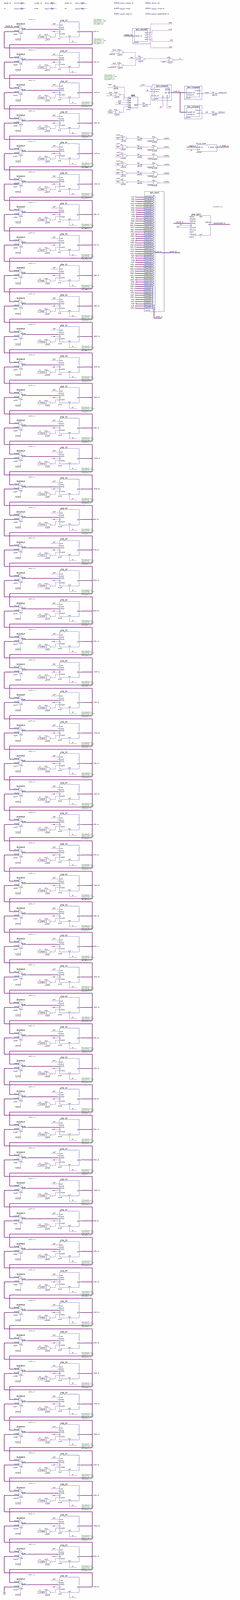
[diagram p0: schematic sheet, whole]
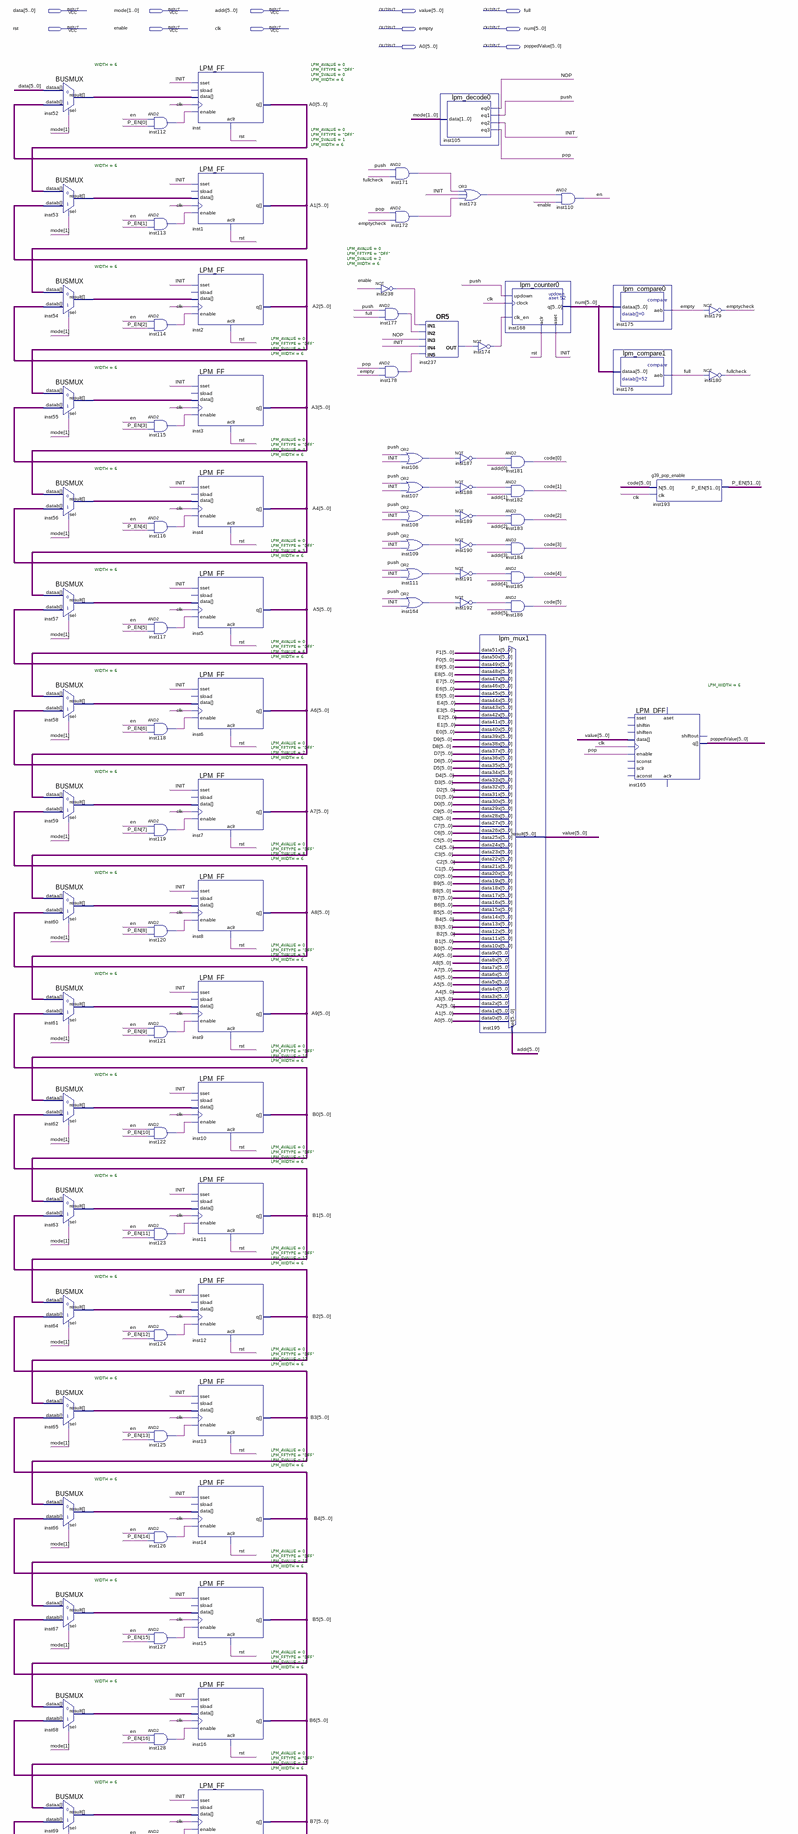
[diagram p1: schematic sheet, upper part]
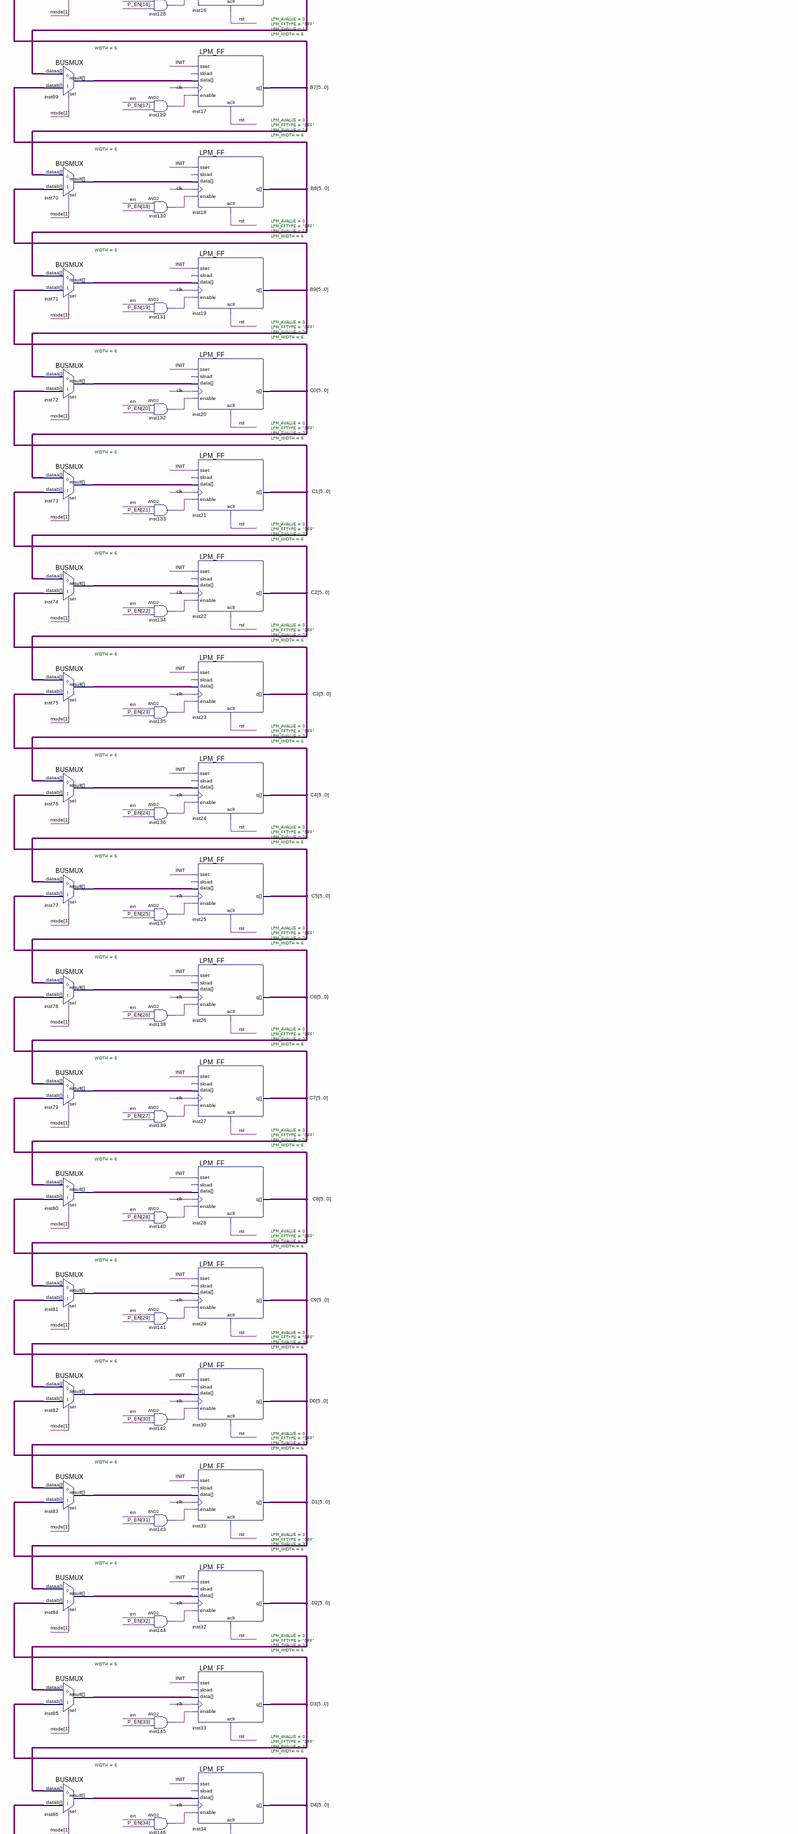
[diagram p2: schematic sheet, middle part]
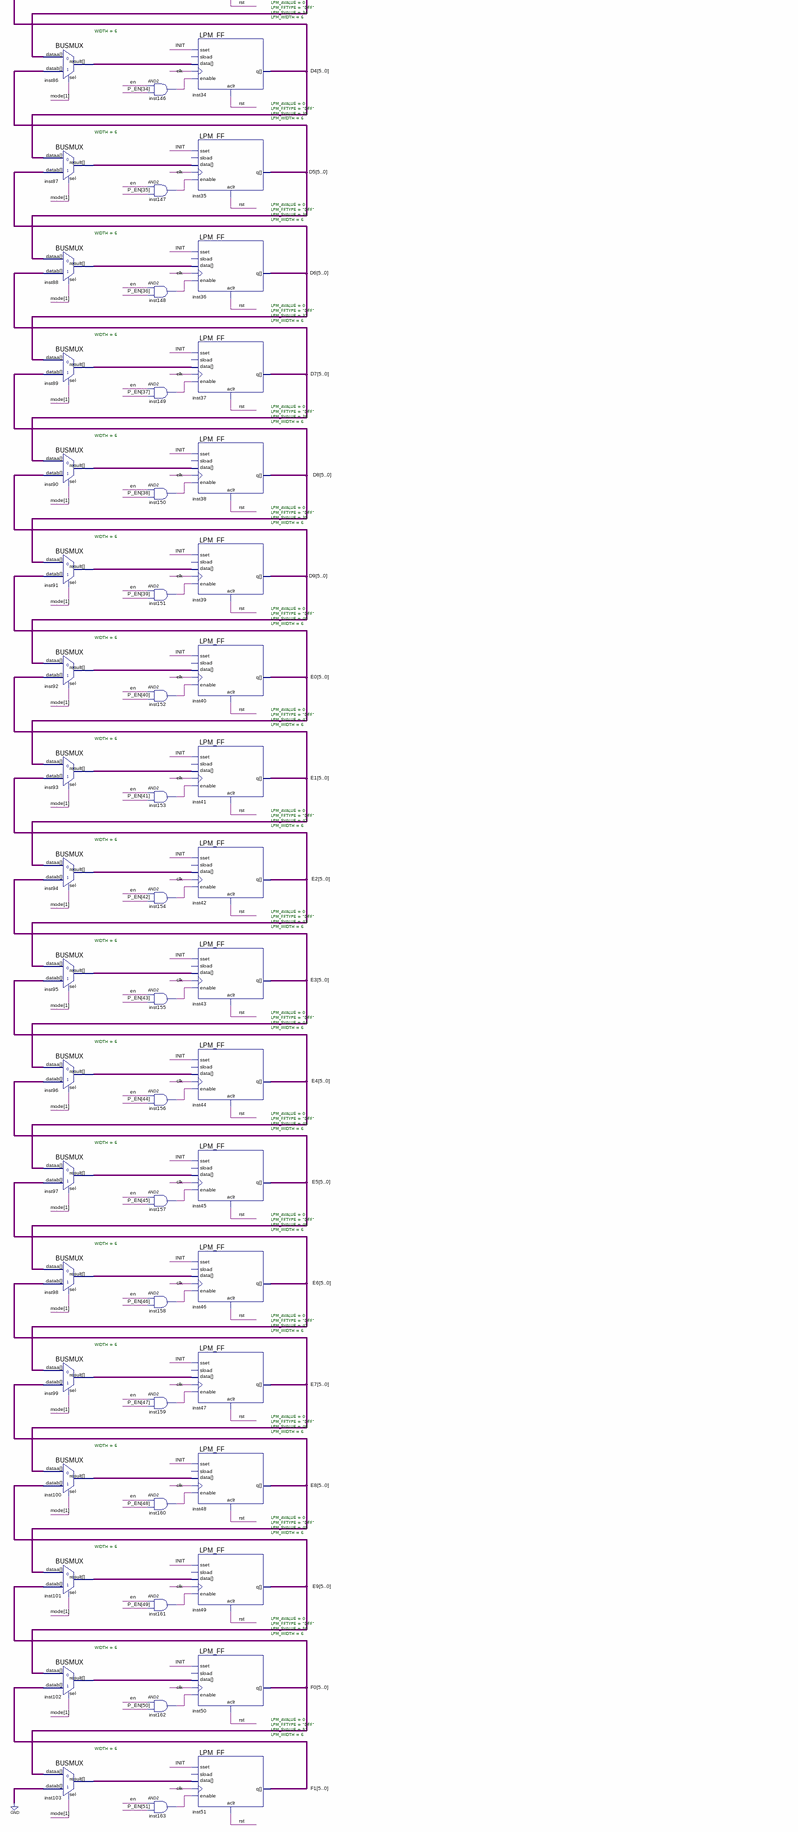
[diagram p3: schematic sheet, lower part]
// Quartus schematic g39_lab3.bdf as structural Verilog: 192 symbols, 12 pins
module g39_lab3 (
  input  [5:0] data,
  input  [1:0] mode,
  input  [5:0] addr,
  input  rst,
  input  enable,
  input  clk,
  output [5:0] value,
  output full,
  output empty,
  output [5:0] num,
  output [5:0] A0,
  output [5:0] poppedValue
);

  wire emptycheck, en, fullcheck, INIT, inst106_out, inst107_out, inst108_out, inst109_out, inst111_out,
       inst112_out, inst113_out, inst114_out, inst115_out, inst116_out, inst117_out, inst118_out,
       inst119_out, inst120_out, inst121_out, inst122_out, inst123_out, inst124_out, inst125_out,
       inst126_out, inst127_out, inst128_out, inst129_out, inst130_out, inst131_out, inst132_out,
       inst133_out, inst134_out, inst135_out, inst136_out, inst137_out, inst138_out, inst139_out,
       inst140_out, inst141_out, inst142_out, inst143_out, inst144_out, inst145_out, inst146_out,
       inst147_out, inst148_out, inst149_out, inst150_out, inst151_out, inst152_out, inst153_out,
       inst154_out, inst155_out, inst156_out, inst157_out, inst158_out, inst159_out, inst160_out,
       inst161_out, inst162_out, inst163_out, inst164_out, inst171_out, inst172_out, inst173_out,
       inst174_out, inst177_out, inst178_out, inst187_out, inst188_out, inst189_out, inst190_out,
       inst191_out, inst192_out, inst237_out, inst238_out, NOP, pop, push;
  wire [5:0] A1, A2, A3, A4, A5, A6, A7, A8, A9, B0, B1, B2, B3, B4, B5, B6, B7, B8, B9, C0, C1, C2, C3, C4,
       C5, C6, C7, C8, C9, code, D0, D1, D2, D3, D4, D5, D6, D7, D8, D9, E0, E1, E2, E3, E4, E5, E6, E7, E8,
       E9, F0, F1, inst52_result, inst53_result, inst54_result, inst55_result, inst56_result, inst57_result,
       inst58_result, inst59_result, inst60_result, inst61_result, inst62_result, inst63_result,
       inst64_result, inst65_result, inst66_result, inst67_result, inst68_result, inst69_result,
       inst70_result, inst71_result, inst72_result, inst73_result, inst74_result, inst75_result,
       inst76_result, inst77_result, inst78_result, inst79_result, inst80_result, inst81_result,
       inst82_result, inst83_result, inst84_result, inst85_result, inst86_result, inst87_result,
       inst88_result, inst89_result, inst90_result, inst91_result, inst92_result, inst93_result,
       inst94_result, inst95_result, inst96_result, inst97_result, inst98_result, inst99_result,
       inst100_result, inst101_result, inst102_result, inst103_result;
  wire [51:0] P_EN;

  BUSMUX #(.WIDTH(6)) inst52 (.datab(A1), .sel(mode[1]), .dataa(data), .result(inst52_result));
  BUSMUX #(.WIDTH(6)) inst53 (.datab(A2), .sel(mode[1]), .dataa(A0), .result(inst53_result));
  BUSMUX #(.WIDTH(6)) inst54 (.datab(A3), .sel(mode[1]), .dataa(A1), .result(inst54_result));
  BUSMUX #(.WIDTH(6)) inst55 (.datab(A4), .sel(mode[1]), .dataa(A2), .result(inst55_result));
  BUSMUX #(.WIDTH(6)) inst56 (.datab(A5), .sel(mode[1]), .dataa(A3), .result(inst56_result));
  BUSMUX #(.WIDTH(6)) inst57 (.datab(A6), .sel(mode[1]), .dataa(A4), .result(inst57_result));
  BUSMUX #(.WIDTH(6)) inst58 (.datab(A7), .sel(mode[1]), .dataa(A5), .result(inst58_result));
  BUSMUX #(.WIDTH(6)) inst59 (.datab(A8), .sel(mode[1]), .dataa(A6), .result(inst59_result));
  BUSMUX #(.WIDTH(6)) inst60 (.datab(A9), .sel(mode[1]), .dataa(A7), .result(inst60_result));
  BUSMUX #(.WIDTH(6)) inst61 (.datab(B0), .sel(mode[1]), .dataa(A8), .result(inst61_result));
  BUSMUX #(.WIDTH(6)) inst62 (.datab(B1), .sel(mode[1]), .dataa(A9), .result(inst62_result));
  BUSMUX #(.WIDTH(6)) inst63 (.datab(B2), .sel(mode[1]), .dataa(B0), .result(inst63_result));
  BUSMUX #(.WIDTH(6)) inst64 (.datab(B3), .sel(mode[1]), .dataa(B1), .result(inst64_result));
  BUSMUX #(.WIDTH(6)) inst65 (.datab(B4), .sel(mode[1]), .dataa(B2), .result(inst65_result));
  BUSMUX #(.WIDTH(6)) inst66 (.datab(B5), .sel(mode[1]), .dataa(B3), .result(inst66_result));
  BUSMUX #(.WIDTH(6)) inst67 (.datab(B6), .sel(mode[1]), .dataa(B4), .result(inst67_result));
  BUSMUX #(.WIDTH(6)) inst68 (.datab(B7), .sel(mode[1]), .dataa(B5), .result(inst68_result));
  BUSMUX #(.WIDTH(6)) inst69 (.datab(B8), .sel(mode[1]), .dataa(B6), .result(inst69_result));
  BUSMUX #(.WIDTH(6)) inst70 (.datab(B9), .sel(mode[1]), .dataa(B7), .result(inst70_result));
  BUSMUX #(.WIDTH(6)) inst71 (.datab(C0), .sel(mode[1]), .dataa(B8), .result(inst71_result));
  BUSMUX #(.WIDTH(6)) inst72 (.datab(C1), .sel(mode[1]), .dataa(B9), .result(inst72_result));
  BUSMUX #(.WIDTH(6)) inst73 (.datab(C2), .sel(mode[1]), .dataa(C0), .result(inst73_result));
  BUSMUX #(.WIDTH(6)) inst74 (.datab(C3), .sel(mode[1]), .dataa(C1), .result(inst74_result));
  BUSMUX #(.WIDTH(6)) inst75 (.datab(C4), .sel(mode[1]), .dataa(C2), .result(inst75_result));
  BUSMUX #(.WIDTH(6)) inst76 (.datab(C5), .sel(mode[1]), .dataa(C3), .result(inst76_result));
  BUSMUX #(.WIDTH(6)) inst77 (.datab(C6), .sel(mode[1]), .dataa(C4), .result(inst77_result));
  BUSMUX #(.WIDTH(6)) inst78 (.datab(C7), .sel(mode[1]), .dataa(C5), .result(inst78_result));
  BUSMUX #(.WIDTH(6)) inst79 (.datab(C8), .sel(mode[1]), .dataa(C6), .result(inst79_result));
  BUSMUX #(.WIDTH(6)) inst80 (.datab(C9), .sel(mode[1]), .dataa(C7), .result(inst80_result));
  BUSMUX #(.WIDTH(6)) inst81 (.datab(D0), .sel(mode[1]), .dataa(C8), .result(inst81_result));
  BUSMUX #(.WIDTH(6)) inst82 (.datab(D1), .sel(mode[1]), .dataa(C9), .result(inst82_result));
  BUSMUX #(.WIDTH(6)) inst83 (.datab(D2), .sel(mode[1]), .dataa(D0), .result(inst83_result));
  BUSMUX #(.WIDTH(6)) inst84 (.datab(D3), .sel(mode[1]), .dataa(D1), .result(inst84_result));
  BUSMUX #(.WIDTH(6)) inst85 (.datab(D4), .sel(mode[1]), .dataa(D2), .result(inst85_result));
  BUSMUX #(.WIDTH(6)) inst86 (.datab(D5), .sel(mode[1]), .dataa(D3), .result(inst86_result));
  BUSMUX #(.WIDTH(6)) inst87 (.datab(D6), .sel(mode[1]), .dataa(D4), .result(inst87_result));
  BUSMUX #(.WIDTH(6)) inst88 (.datab(D7), .sel(mode[1]), .dataa(D5), .result(inst88_result));
  BUSMUX #(.WIDTH(6)) inst89 (.datab(D8), .sel(mode[1]), .dataa(D6), .result(inst89_result));
  BUSMUX #(.WIDTH(6)) inst90 (.datab(D9), .sel(mode[1]), .dataa(D7), .result(inst90_result));
  BUSMUX #(.WIDTH(6)) inst91 (.datab(E0), .sel(mode[1]), .dataa(D8), .result(inst91_result));
  BUSMUX #(.WIDTH(6)) inst92 (.datab(E1), .sel(mode[1]), .dataa(D9), .result(inst92_result));
  BUSMUX #(.WIDTH(6)) inst93 (.datab(E2), .sel(mode[1]), .dataa(E0), .result(inst93_result));
  BUSMUX #(.WIDTH(6)) inst94 (.datab(E3), .sel(mode[1]), .dataa(E1), .result(inst94_result));
  BUSMUX #(.WIDTH(6)) inst95 (.datab(E4), .sel(mode[1]), .dataa(E2), .result(inst95_result));
  BUSMUX #(.WIDTH(6)) inst96 (.datab(E5), .sel(mode[1]), .dataa(E3), .result(inst96_result));
  BUSMUX #(.WIDTH(6)) inst97 (.datab(E6), .sel(mode[1]), .dataa(E4), .result(inst97_result));
  BUSMUX #(.WIDTH(6)) inst98 (.datab(E7), .sel(mode[1]), .dataa(E5), .result(inst98_result));
  BUSMUX #(.WIDTH(6)) inst99 (.datab(E8), .sel(mode[1]), .dataa(E6), .result(inst99_result));
  BUSMUX #(.WIDTH(6)) inst100 (.datab(E9), .sel(mode[1]), .dataa(E7), .result(inst100_result));
  BUSMUX #(.WIDTH(6)) inst101 (.datab(F0), .sel(mode[1]), .dataa(E8), .result(inst101_result));
  BUSMUX #(.WIDTH(6)) inst102 (.datab(F1), .sel(mode[1]), .dataa(E9), .result(inst102_result));
  BUSMUX #(.WIDTH(6)) inst103 (.datab({6{1'b0}}), .sel(mode[1]), .dataa(F0), .result(inst103_result));
  and inst112 (inst112_out, en, P_EN[0]);
  and inst113 (inst113_out, en, P_EN[1]);
  and inst114 (inst114_out, en, P_EN[2]);
  and inst115 (inst115_out, en, P_EN[3]);
  and inst116 (inst116_out, en, P_EN[4]);
  and inst117 (inst117_out, en, P_EN[5]);
  and inst118 (inst118_out, en, P_EN[6]);
  and inst119 (inst119_out, en, P_EN[7]);
  and inst120 (inst120_out, en, P_EN[8]);
  and inst121 (inst121_out, en, P_EN[9]);
  and inst122 (inst122_out, en, P_EN[10]);
  and inst123 (inst123_out, en, P_EN[11]);
  and inst124 (inst124_out, en, P_EN[12]);
  and inst125 (inst125_out, en, P_EN[13]);
  and inst126 (inst126_out, en, P_EN[14]);
  and inst127 (inst127_out, en, P_EN[15]);
  and inst128 (inst128_out, en, P_EN[16]);
  and inst129 (inst129_out, en, P_EN[17]);
  and inst130 (inst130_out, en, P_EN[18]);
  and inst131 (inst131_out, en, P_EN[19]);
  and inst132 (inst132_out, en, P_EN[20]);
  and inst133 (inst133_out, en, P_EN[21]);
  and inst134 (inst134_out, en, P_EN[22]);
  and inst135 (inst135_out, en, P_EN[23]);
  and inst136 (inst136_out, en, P_EN[24]);
  and inst137 (inst137_out, en, P_EN[25]);
  and inst138 (inst138_out, en, P_EN[26]);
  and inst139 (inst139_out, en, P_EN[27]);
  and inst140 (inst140_out, en, P_EN[28]);
  and inst141 (inst141_out, en, P_EN[29]);
  and inst142 (inst142_out, en, P_EN[30]);
  and inst143 (inst143_out, en, P_EN[31]);
  and inst144 (inst144_out, en, P_EN[32]);
  and inst145 (inst145_out, en, P_EN[33]);
  and inst146 (inst146_out, en, P_EN[34]);
  and inst147 (inst147_out, en, P_EN[35]);
  and inst148 (inst148_out, en, P_EN[36]);
  and inst149 (inst149_out, en, P_EN[37]);
  and inst150 (inst150_out, en, P_EN[38]);
  and inst151 (inst151_out, en, P_EN[39]);
  and inst152 (inst152_out, en, P_EN[40]);
  and inst153 (inst153_out, en, P_EN[41]);
  and inst154 (inst154_out, en, P_EN[42]);
  and inst155 (inst155_out, en, P_EN[43]);
  and inst156 (inst156_out, en, P_EN[44]);
  and inst157 (inst157_out, en, P_EN[45]);
  and inst158 (inst158_out, en, P_EN[46]);
  and inst159 (inst159_out, en, P_EN[47]);
  and inst160 (inst160_out, en, P_EN[48]);
  and inst161 (inst161_out, en, P_EN[49]);
  and inst162 (inst162_out, en, P_EN[50]);
  and inst163 (inst163_out, en, P_EN[51]);
  LPM_FF #(.LPM_AVALUE(0), .LPM_FFTYPE("DFF"), .LPM_SVALUE(0), .LPM_WIDTH(6)) inst (
    .enable(inst112_out), .clock(clk), .sset(INIT), .aclr(rst), .data(inst52_result), .q(A0));  // open: sload
  LPM_FF #(.LPM_AVALUE(0), .LPM_FFTYPE("DFF"), .LPM_SVALUE(1), .LPM_WIDTH(6)) inst1 (
    .enable(inst113_out), .clock(clk), .sset(INIT), .aclr(rst), .data(inst53_result), .q(A1));  // open: sload
  LPM_FF #(.LPM_AVALUE(0), .LPM_FFTYPE("DFF"), .LPM_SVALUE(2), .LPM_WIDTH(6)) inst2 (
    .enable(inst114_out), .clock(clk), .sset(INIT), .aclr(rst), .data(inst54_result), .q(A2));  // open: sload
  LPM_FF #(.LPM_AVALUE(0), .LPM_FFTYPE("DFF"), .LPM_SVALUE(3), .LPM_WIDTH(6)) inst3 (
    .enable(inst115_out), .clock(clk), .sset(INIT), .aclr(rst), .data(inst55_result), .q(A3));  // open: sload
  LPM_FF #(.LPM_AVALUE(0), .LPM_FFTYPE("DFF"), .LPM_SVALUE(4), .LPM_WIDTH(6)) inst4 (
    .enable(inst116_out), .clock(clk), .sset(INIT), .aclr(rst), .data(inst56_result), .q(A4));  // open: sload
  LPM_FF #(.LPM_AVALUE(0), .LPM_FFTYPE("DFF"), .LPM_SVALUE(5), .LPM_WIDTH(6)) inst5 (
    .enable(inst117_out), .clock(clk), .sset(INIT), .aclr(rst), .data(inst57_result), .q(A5));  // open: sload
  LPM_FF #(.LPM_AVALUE(0), .LPM_FFTYPE("DFF"), .LPM_SVALUE(6), .LPM_WIDTH(6)) inst6 (
    .enable(inst118_out), .clock(clk), .sset(INIT), .aclr(rst), .data(inst58_result), .q(A6));  // open: sload
  LPM_FF #(.LPM_AVALUE(0), .LPM_FFTYPE("DFF"), .LPM_SVALUE(7), .LPM_WIDTH(6)) inst7 (
    .enable(inst119_out), .clock(clk), .sset(INIT), .aclr(rst), .data(inst59_result), .q(A7));  // open: sload
  LPM_FF #(.LPM_AVALUE(0), .LPM_FFTYPE("DFF"), .LPM_SVALUE(8), .LPM_WIDTH(6)) inst8 (
    .enable(inst120_out), .clock(clk), .sset(INIT), .aclr(rst), .data(inst60_result), .q(A8));  // open: sload
  LPM_FF #(.LPM_AVALUE(0), .LPM_FFTYPE("DFF"), .LPM_SVALUE(9), .LPM_WIDTH(6)) inst9 (
    .enable(inst121_out), .clock(clk), .sset(INIT), .aclr(rst), .data(inst61_result), .q(A9));  // open: sload
  LPM_FF #(.LPM_AVALUE(0), .LPM_FFTYPE("DFF"), .LPM_SVALUE(10), .LPM_WIDTH(6)) inst10 (
    .enable(inst122_out), .clock(clk), .sset(INIT), .aclr(rst), .data(inst62_result), .q(B0));  // open: sload
  LPM_FF #(.LPM_AVALUE(0), .LPM_FFTYPE("DFF"), .LPM_SVALUE(11), .LPM_WIDTH(6)) inst11 (
    .enable(inst123_out), .clock(clk), .sset(INIT), .aclr(rst), .data(inst63_result), .q(B1));  // open: sload
  LPM_FF #(.LPM_AVALUE(0), .LPM_FFTYPE("DFF"), .LPM_SVALUE(12), .LPM_WIDTH(6)) inst12 (
    .enable(inst124_out), .clock(clk), .sset(INIT), .aclr(rst), .data(inst64_result), .q(B2));  // open: sload
  LPM_FF #(.LPM_AVALUE(0), .LPM_FFTYPE("DFF"), .LPM_SVALUE(13), .LPM_WIDTH(6)) inst13 (
    .enable(inst125_out), .clock(clk), .sset(INIT), .aclr(rst), .data(inst65_result), .q(B3));  // open: sload
  LPM_FF #(.LPM_AVALUE(0), .LPM_FFTYPE("DFF"), .LPM_SVALUE(14), .LPM_WIDTH(6)) inst14 (
    .enable(inst126_out), .clock(clk), .sset(INIT), .aclr(rst), .data(inst66_result), .q(B4));  // open: sload
  LPM_FF #(.LPM_AVALUE(0), .LPM_FFTYPE("DFF"), .LPM_SVALUE(15), .LPM_WIDTH(6)) inst15 (
    .enable(inst127_out), .clock(clk), .sset(INIT), .aclr(rst), .data(inst67_result), .q(B5));  // open: sload
  LPM_FF #(.LPM_AVALUE(0), .LPM_FFTYPE("DFF"), .LPM_SVALUE(16), .LPM_WIDTH(6)) inst16 (
    .enable(inst128_out), .clock(clk), .sset(INIT), .aclr(rst), .data(inst68_result), .q(B6));  // open: sload
  LPM_FF #(.LPM_AVALUE(0), .LPM_FFTYPE("DFF"), .LPM_SVALUE(17), .LPM_WIDTH(6)) inst17 (
    .enable(inst129_out), .clock(clk), .sset(INIT), .aclr(rst), .data(inst69_result), .q(B7));  // open: sload
  LPM_FF #(.LPM_AVALUE(0), .LPM_FFTYPE("DFF"), .LPM_SVALUE(18), .LPM_WIDTH(6)) inst18 (
    .enable(inst130_out), .clock(clk), .sset(INIT), .aclr(rst), .data(inst70_result), .q(B8));  // open: sload
  LPM_FF #(.LPM_AVALUE(0), .LPM_FFTYPE("DFF"), .LPM_SVALUE(19), .LPM_WIDTH(6)) inst19 (
    .enable(inst131_out), .clock(clk), .sset(INIT), .aclr(rst), .data(inst71_result), .q(B9));  // open: sload
  LPM_FF #(.LPM_AVALUE(0), .LPM_FFTYPE("DFF"), .LPM_SVALUE(20), .LPM_WIDTH(6)) inst20 (
    .enable(inst132_out), .clock(clk), .sset(INIT), .aclr(rst), .data(inst72_result), .q(C0));  // open: sload
  LPM_FF #(.LPM_AVALUE(0), .LPM_FFTYPE("DFF"), .LPM_SVALUE(21), .LPM_WIDTH(6)) inst21 (
    .enable(inst133_out), .clock(clk), .sset(INIT), .aclr(rst), .data(inst73_result), .q(C1));  // open: sload
  LPM_FF #(.LPM_AVALUE(0), .LPM_FFTYPE("DFF"), .LPM_SVALUE(22), .LPM_WIDTH(6)) inst22 (
    .enable(inst134_out), .clock(clk), .sset(INIT), .aclr(rst), .data(inst74_result), .q(C2));  // open: sload
  LPM_FF #(.LPM_AVALUE(0), .LPM_FFTYPE("DFF"), .LPM_SVALUE(23), .LPM_WIDTH(6)) inst23 (
    .enable(inst135_out), .clock(clk), .sset(INIT), .aclr(rst), .data(inst75_result), .q(C3));  // open: sload
  LPM_FF #(.LPM_AVALUE(0), .LPM_FFTYPE("DFF"), .LPM_SVALUE(24), .LPM_WIDTH(6)) inst24 (
    .enable(inst136_out), .clock(clk), .sset(INIT), .aclr(rst), .data(inst76_result), .q(C4));  // open: sload
  LPM_FF #(.LPM_AVALUE(0), .LPM_FFTYPE("DFF"), .LPM_SVALUE(25), .LPM_WIDTH(6)) inst25 (
    .enable(inst137_out), .clock(clk), .sset(INIT), .aclr(rst), .data(inst77_result), .q(C5));  // open: sload
  LPM_FF #(.LPM_AVALUE(0), .LPM_FFTYPE("DFF"), .LPM_SVALUE(26), .LPM_WIDTH(6)) inst26 (
    .enable(inst138_out), .clock(clk), .sset(INIT), .aclr(rst), .data(inst78_result), .q(C6));  // open: sload
  LPM_FF #(.LPM_AVALUE(0), .LPM_FFTYPE("DFF"), .LPM_SVALUE(27), .LPM_WIDTH(6)) inst27 (
    .enable(inst139_out), .clock(clk), .sset(INIT), .aclr(rst), .data(inst79_result), .q(C7));  // open: sload
  LPM_FF #(.LPM_AVALUE(0), .LPM_FFTYPE("DFF"), .LPM_SVALUE(28), .LPM_WIDTH(6)) inst28 (
    .enable(inst140_out), .clock(clk), .sset(INIT), .aclr(rst), .data(inst80_result), .q(C8));  // open: sload
  LPM_FF #(.LPM_AVALUE(0), .LPM_FFTYPE("DFF"), .LPM_SVALUE(29), .LPM_WIDTH(6)) inst29 (
    .enable(inst141_out), .clock(clk), .sset(INIT), .aclr(rst), .data(inst81_result), .q(C9));  // open: sload
  LPM_FF #(.LPM_AVALUE(0), .LPM_FFTYPE("DFF"), .LPM_SVALUE(30), .LPM_WIDTH(6)) inst30 (
    .enable(inst142_out), .clock(clk), .sset(INIT), .aclr(rst), .data(inst82_result), .q(D0));  // open: sload
  LPM_FF #(.LPM_AVALUE(0), .LPM_FFTYPE("DFF"), .LPM_SVALUE(31), .LPM_WIDTH(6)) inst31 (
    .enable(inst143_out), .clock(clk), .sset(INIT), .aclr(rst), .data(inst83_result), .q(D1));  // open: sload
  LPM_FF #(.LPM_AVALUE(0), .LPM_FFTYPE("DFF"), .LPM_SVALUE(32), .LPM_WIDTH(6)) inst32 (
    .enable(inst144_out), .clock(clk), .sset(INIT), .aclr(rst), .data(inst84_result), .q(D2));  // open: sload
  LPM_FF #(.LPM_AVALUE(0), .LPM_FFTYPE("DFF"), .LPM_SVALUE(33), .LPM_WIDTH(6)) inst33 (
    .enable(inst145_out), .clock(clk), .sset(INIT), .aclr(rst), .data(inst85_result), .q(D3));  // open: sload
  LPM_FF #(.LPM_AVALUE(0), .LPM_FFTYPE("DFF"), .LPM_SVALUE(34), .LPM_WIDTH(6)) inst34 (
    .enable(inst146_out), .clock(clk), .sset(INIT), .aclr(rst), .data(inst86_result), .q(D4));  // open: sload
  LPM_FF #(.LPM_AVALUE(0), .LPM_FFTYPE("DFF"), .LPM_SVALUE(35), .LPM_WIDTH(6)) inst35 (
    .enable(inst147_out), .clock(clk), .sset(INIT), .aclr(rst), .data(inst87_result), .q(D5));  // open: sload
  LPM_FF #(.LPM_AVALUE(0), .LPM_FFTYPE("DFF"), .LPM_SVALUE(36), .LPM_WIDTH(6)) inst36 (
    .enable(inst148_out), .clock(clk), .sset(INIT), .aclr(rst), .data(inst88_result), .q(D6));  // open: sload
  LPM_FF #(.LPM_AVALUE(0), .LPM_FFTYPE("DFF"), .LPM_SVALUE(37), .LPM_WIDTH(6)) inst37 (
    .enable(inst149_out), .clock(clk), .sset(INIT), .aclr(rst), .data(inst89_result), .q(D7));  // open: sload
  LPM_FF #(.LPM_AVALUE(0), .LPM_FFTYPE("DFF"), .LPM_SVALUE(38), .LPM_WIDTH(6)) inst38 (
    .enable(inst150_out), .clock(clk), .sset(INIT), .aclr(rst), .data(inst90_result), .q(D8));  // open: sload
  LPM_FF #(.LPM_AVALUE(0), .LPM_FFTYPE("DFF"), .LPM_SVALUE(39), .LPM_WIDTH(6)) inst39 (
    .enable(inst151_out), .clock(clk), .sset(INIT), .aclr(rst), .data(inst91_result), .q(D9));  // open: sload
  LPM_FF #(.LPM_AVALUE(0), .LPM_FFTYPE("DFF"), .LPM_SVALUE(40), .LPM_WIDTH(6)) inst40 (
    .enable(inst152_out), .clock(clk), .sset(INIT), .aclr(rst), .data(inst92_result), .q(E0));  // open: sload
  LPM_FF #(.LPM_AVALUE(0), .LPM_FFTYPE("DFF"), .LPM_SVALUE(41), .LPM_WIDTH(6)) inst41 (
    .enable(inst153_out), .clock(clk), .sset(INIT), .aclr(rst), .data(inst93_result), .q(E1));  // open: sload
  LPM_FF #(.LPM_AVALUE(0), .LPM_FFTYPE("DFF"), .LPM_SVALUE(42), .LPM_WIDTH(6)) inst42 (
    .enable(inst154_out), .clock(clk), .sset(INIT), .aclr(rst), .data(inst94_result), .q(E2));  // open: sload
  LPM_FF #(.LPM_AVALUE(0), .LPM_FFTYPE("DFF"), .LPM_SVALUE(43), .LPM_WIDTH(6)) inst43 (
    .enable(inst155_out), .clock(clk), .sset(INIT), .aclr(rst), .data(inst95_result), .q(E3));  // open: sload
  LPM_FF #(.LPM_AVALUE(0), .LPM_FFTYPE("DFF"), .LPM_SVALUE(44), .LPM_WIDTH(6)) inst44 (
    .enable(inst156_out), .clock(clk), .sset(INIT), .aclr(rst), .data(inst96_result), .q(E4));  // open: sload
  LPM_FF #(.LPM_AVALUE(0), .LPM_FFTYPE("DFF"), .LPM_SVALUE(45), .LPM_WIDTH(6)) inst45 (
    .enable(inst157_out), .clock(clk), .sset(INIT), .aclr(rst), .data(inst97_result), .q(E5));  // open: sload
  LPM_FF #(.LPM_AVALUE(0), .LPM_FFTYPE("DFF"), .LPM_SVALUE(46), .LPM_WIDTH(6)) inst46 (
    .enable(inst158_out), .clock(clk), .sset(INIT), .aclr(rst), .data(inst98_result), .q(E6));  // open: sload
  LPM_FF #(.LPM_AVALUE(0), .LPM_FFTYPE("DFF"), .LPM_SVALUE(47), .LPM_WIDTH(6)) inst47 (
    .enable(inst159_out), .clock(clk), .sset(INIT), .aclr(rst), .data(inst99_result), .q(E7));  // open: sload
  LPM_FF #(.LPM_AVALUE(0), .LPM_FFTYPE("DFF"), .LPM_SVALUE(48), .LPM_WIDTH(6)) inst48 (
    .enable(inst160_out), .clock(clk), .sset(INIT), .aclr(rst), .data(inst100_result), .q(E8));  // open: sload
  LPM_FF #(.LPM_AVALUE(0), .LPM_FFTYPE("DFF"), .LPM_SVALUE(49), .LPM_WIDTH(6)) inst49 (
    .enable(inst161_out), .clock(clk), .sset(INIT), .aclr(rst), .data(inst101_result), .q(E9));  // open: sload
  LPM_FF #(.LPM_AVALUE(0), .LPM_FFTYPE("DFF"), .LPM_SVALUE(50), .LPM_WIDTH(6)) inst50 (
    .enable(inst162_out), .clock(clk), .sset(INIT), .aclr(rst), .data(inst102_result), .q(F0));  // open: sload
  LPM_FF #(.LPM_AVALUE(0), .LPM_FFTYPE("DFF"), .LPM_SVALUE(51), .LPM_WIDTH(6)) inst51 (
    .enable(inst163_out), .clock(clk), .sset(INIT), .aclr(rst), .data(inst103_result), .q(F1));  // open: sload
  and inst171 (inst171_out, push, fullcheck);
  and inst172 (inst172_out, pop, emptycheck);
  not inst238 (inst238_out, enable);
  and inst177 (inst177_out, push, full);
  and inst178 (inst178_out, pop, empty);
  or inst237 (inst237_out, inst238_out, inst177_out, NOP, INIT, inst178_out);
  or inst106 (inst106_out, push, INIT);
  or inst107 (inst107_out, push, INIT);
  or inst108 (inst108_out, push, INIT);
  or inst109 (inst109_out, push, INIT);
  or inst111 (inst111_out, push, INIT);
  or inst164 (inst164_out, push, INIT);
  lpm_decode0 inst105 (.data(mode), .eq0(NOP), .eq1(push), .eq2(INIT), .eq3(pop));
  or inst173 (inst173_out, inst171_out, INIT, inst172_out);
  not inst174 (inst174_out, inst237_out);
  not inst187 (inst187_out, inst106_out);
  not inst188 (inst188_out, inst107_out);
  not inst189 (inst189_out, inst108_out);
  not inst190 (inst190_out, inst109_out);
  not inst191 (inst191_out, inst111_out);
  not inst192 (inst192_out, inst164_out);
  lpm_counter0 inst168 (.updown(push), .clock(clk), .clk_en(inst174_out), .aclr(rst), .aset(INIT), .q(num));
  and inst181 (code[0], inst187_out, addr[0]);
  and inst182 (code[1], inst188_out, addr[1]);
  and inst183 (code[2], inst189_out, addr[2]);
  and inst184 (code[3], inst190_out, addr[3]);
  and inst185 (code[4], inst191_out, addr[4]);
  and inst186 (code[5], inst192_out, addr[5]);
  lpm_mux1 inst195 (
    .data51x(F1), .data50x(F0), .data49x(E9), .data48x(E8), .data47x(E7), .data46x(E6), .data45x(E5),
    .data44x(E4), .data43x(E3), .data42x(E2), .data41x(E1), .data40x(E0), .data39x(D9), .data38x(D8),
    .data37x(D7), .data36x(D6), .data35x(D5), .data34x(D4), .data33x(D3), .data32x(D2), .data31x(D1),
    .data30x(D0), .data29x(C9), .data28x(C8), .data27x(C7), .data26x(C6), .data25x(C5), .data24x(C4),
    .data23x(C3), .data22x(C2), .data21x(C1), .data20x(C0), .data19x(B9), .data18x(B8), .data17x(B7),
    .data16x(B6), .data15x(B5), .data14x(B4), .data13x(B3), .data12x(B2), .data11x(B1), .data10x(B0),
    .data9x(A9), .data8x(A8), .data7x(A7), .data6x(A6), .data5x(A5), .data4x(A4), .data3x(A3), .data2x(A2),
    .data1x(A1), .data0x(A0), .sel(addr), .result(value));
  and inst110 (en, inst173_out, enable);
  lpm_compare0 inst175 (.dataa(num), .aeb(empty));
  lpm_compare1 inst176 (.dataa(num), .aeb(full));
  g39_pop_enable inst193 (.N(code), .clk(clk), .P_EN(P_EN));
  LPM_DFF #(.LPM_WIDTH(6)) inst165 (
    .enable(pop), .clock(clk), .data(value), .q(poppedValue));  // open: shiftin, shiften, aconst, sclr, sconst, sset, aset, aclr, shiftout
  not inst179 (emptycheck, empty);
  not inst180 (fullcheck, full);
endmodule
